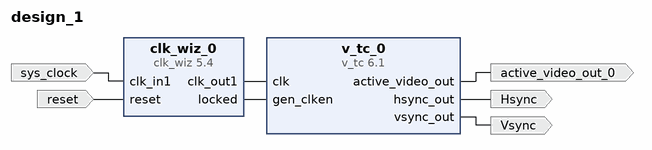
[diagram p0: block diagram of the top level]
# Vivado block design design_1, xc7a35tcpg236-1, Vivado 2017.4
create_bd_design design_1

create_bd_port -dir I -type clk sys_clock
set_property -dict {CONFIG.FREQ_HZ 100000000 CONFIG.PHASE 0.000} [get_bd_ports sys_clock]
create_bd_port -dir I -type rst reset
set_property -dict {CONFIG.POLARITY ACTIVE_HIGH} [get_bd_ports reset]
create_bd_port -dir O active_video_out_0
create_bd_port -dir O Hsync
create_bd_port -dir O Vsync

create_bd_cell -type ip -vlnv xilinx.com:ip:clk_wiz:5.4 clk_wiz_0
set_property -dict [list \
  CONFIG.CLKOUT1_REQUESTED_OUT_FREQ 78 \
  CONFIG.MMCM_DIVCLK_DIVIDE 1 \
  CONFIG.MMCM_CLKFBOUT_MULT_F 9.750 \
  CONFIG.MMCM_CLKOUT0_DIVIDE_F 12.500 \
  CONFIG.USE_BOARD_FLOW true \
  CONFIG.CLK_IN1_BOARD_INTERFACE sys_clock \
  CONFIG.RESET_BOARD_INTERFACE reset \
  CONFIG.CLKOUT1_JITTER 136.923 \
  CONFIG.CLKOUT1_PHASE_ERROR 99.281 \
] [get_bd_cells clk_wiz_0]
create_bd_cell -type ip -vlnv xilinx.com:ip:v_tc:6.1 v_tc_0
set_property -dict [list \
  CONFIG.HAS_AXI4_LITE false \
  CONFIG.VIDEO_MODE 1024x768p \
  CONFIG.enable_detection false \
  CONFIG.vertical_blank_generation false \
  CONFIG.horizontal_blank_generation false \
] [get_bd_cells v_tc_0]

# ---- connections ----

connect_bd_net [get_bd_ports sys_clock] [get_bd_pins clk_wiz_0/clk_in1]
connect_bd_net [get_bd_ports reset] [get_bd_pins clk_wiz_0/reset]
connect_bd_net [get_bd_pins clk_wiz_0/clk_out1] [get_bd_pins v_tc_0/clk]
connect_bd_net [get_bd_pins v_tc_0/active_video_out] [get_bd_ports active_video_out_0]
connect_bd_net [get_bd_pins v_tc_0/hsync_out] [get_bd_ports Hsync]
connect_bd_net [get_bd_pins v_tc_0/vsync_out] [get_bd_ports Vsync]
connect_bd_net [get_bd_pins clk_wiz_0/locked] [get_bd_pins v_tc_0/gen_clken]

validate_bd_design
save_bd_design
